# Altium schematic sheet SDRAM_DDR3_4x16.SchDoc: =ProjectName
size 420 x 297 mm; Author: T.P.; CompanyName: WUT; DrawnBy: T.P.; Organization: WUT ISE; Address1: Warsaw Univeristy of Technology; Address2: Nowowiejska 15/19; DocumentNumber: 23; Revision: 0.9; SheetNumber: 23; SheetTotal: 36; EDA_Number: ARTIQ; Projet: ARTIQ/SINARA; ModifiedBy: -; CreateDate: XX/XX/XXXX; CheckedDate: -; Title2: SDRAM_DDR3_4x16.SchDoc; DivGrp: ISE; Designer: G.K. and T.P.; ModifiedDate: -; ProjectName: ADC/DAC MEZZANINE
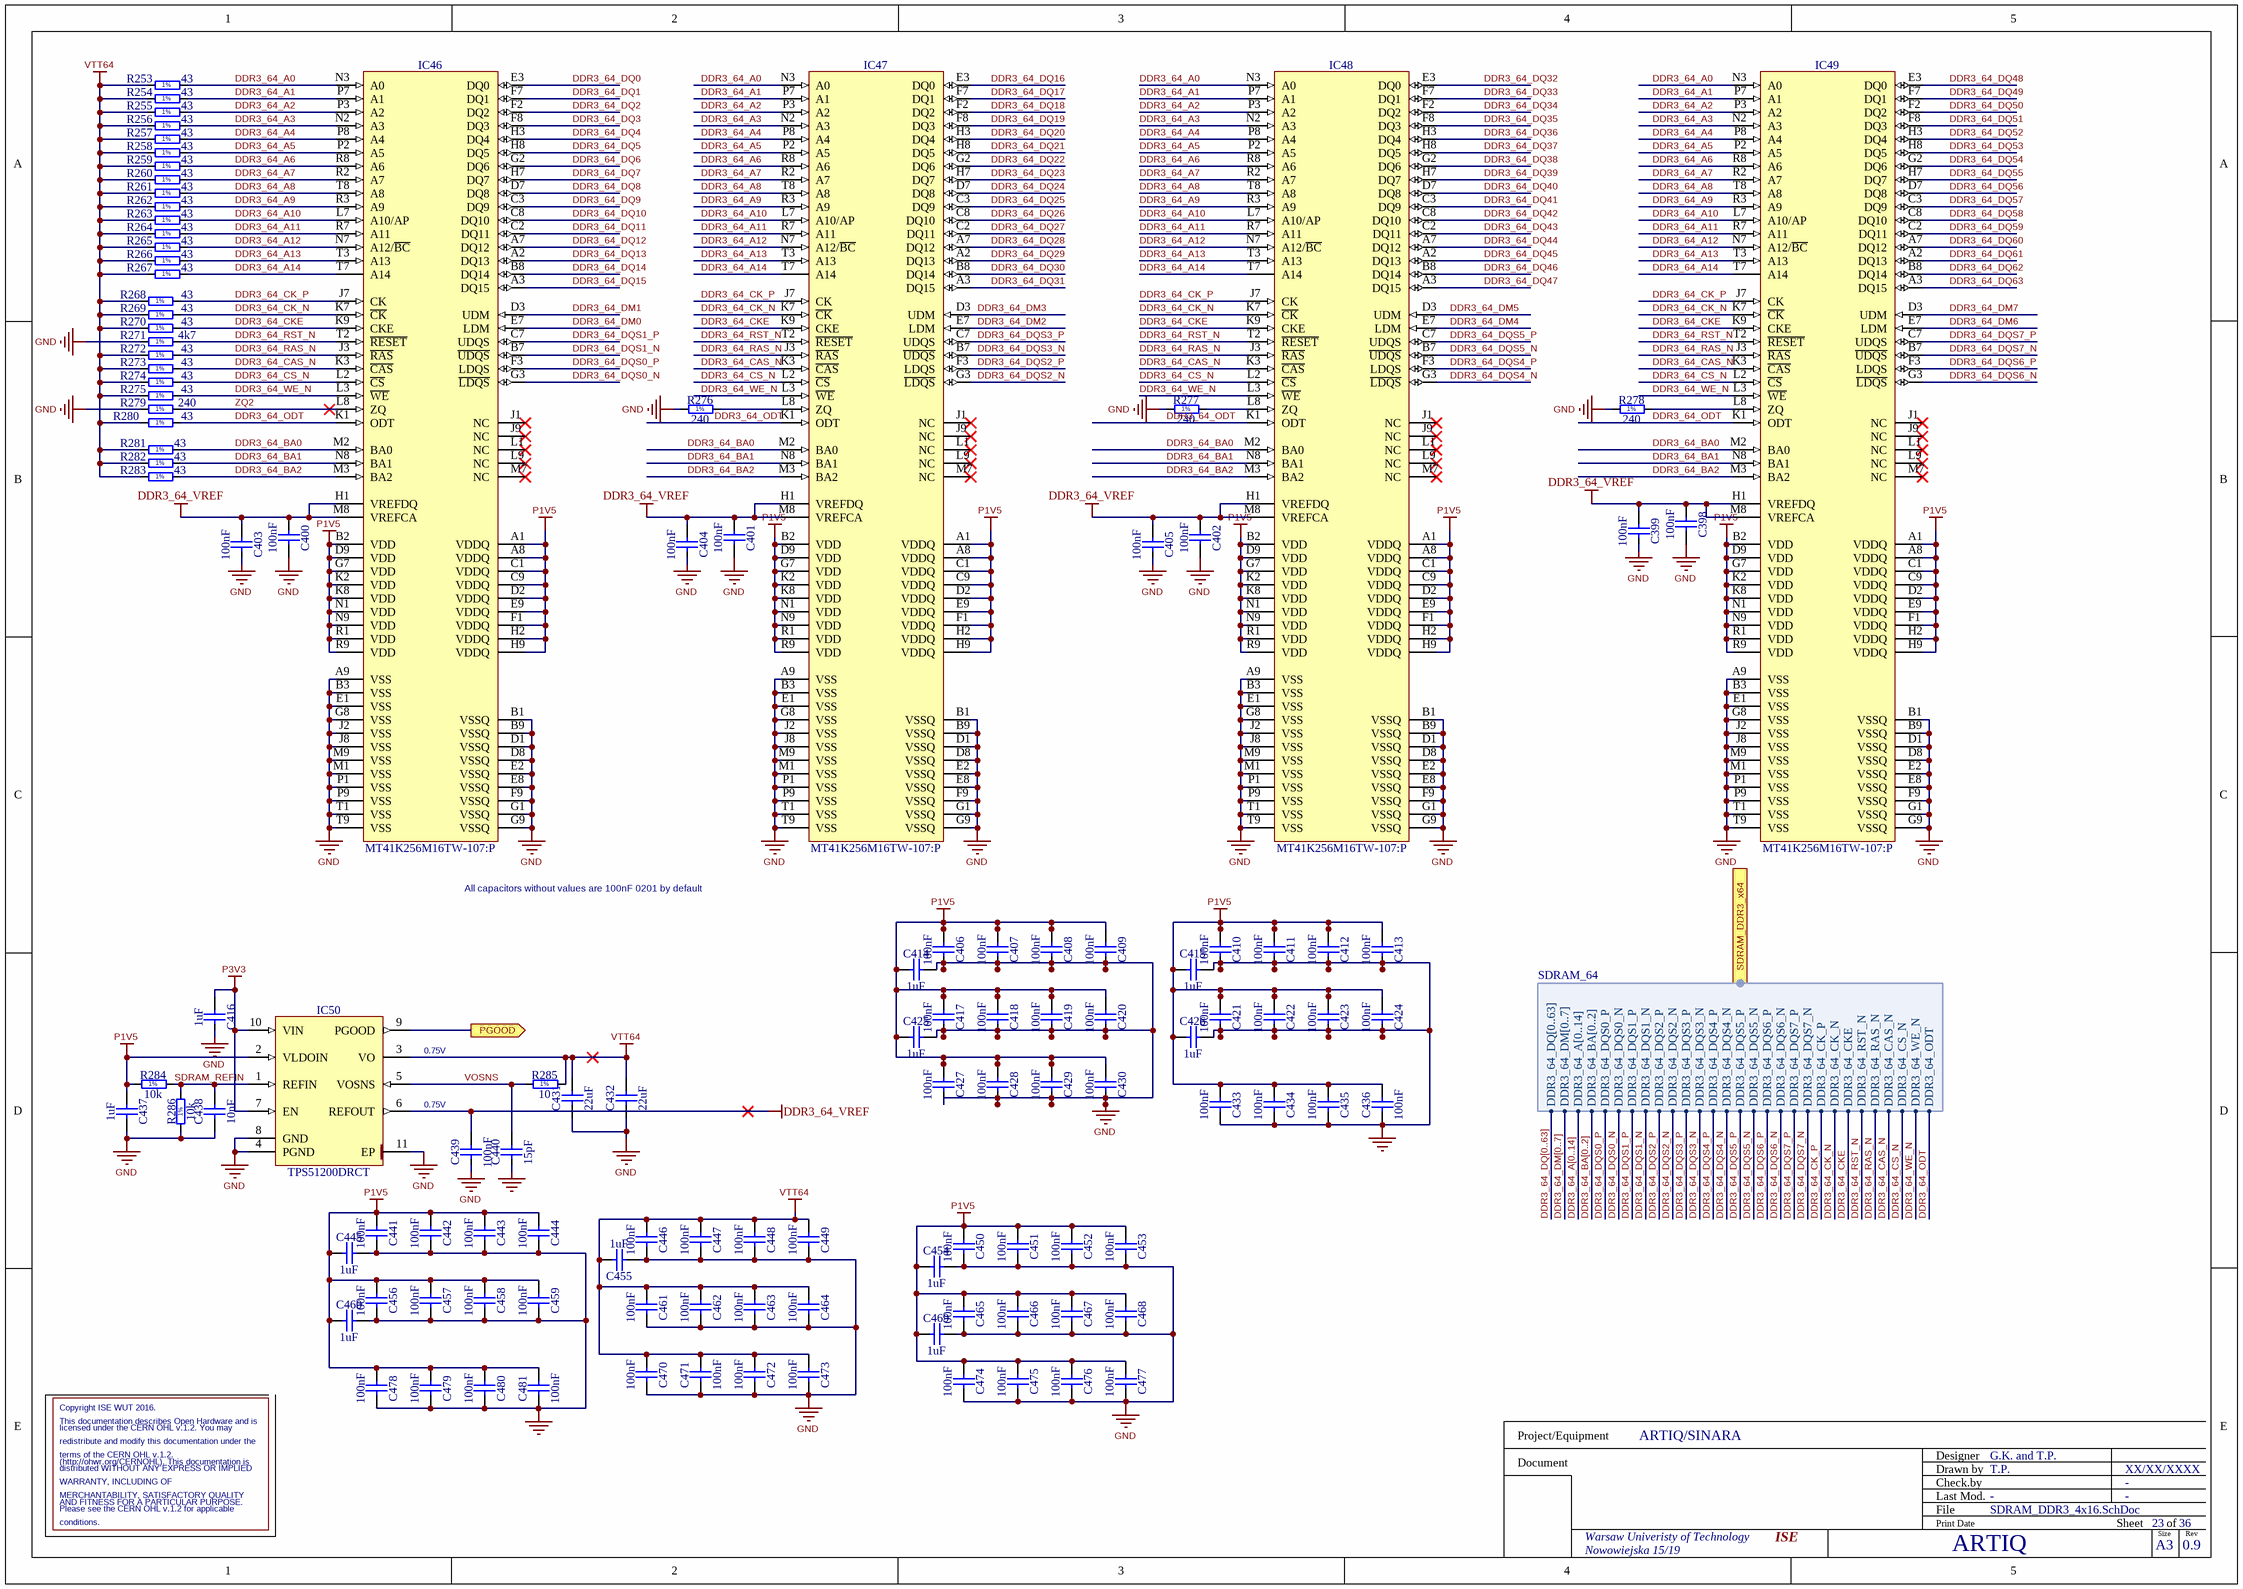
[diagram p0: SDRAM_DDR3_4x16.SchDoc]

## Parts
C398  100nF  [CAPC0603X33N]
C399  100nF  [CAPC0603X33N]
C400  100nF  [CAPC0603X33N]
C401  100nF  [CAPC0603X33N]
C402  100nF  [CAPC0603X33N]
C403  100nF  [CAPC0603X33N]
C404  100nF  [CAPC0603X33N]
C405  100nF  [CAPC0603X33N]
C406  100nF  [CAPC0603X33N]
C407  100nF  [CAPC0603X33N]
C408  100nF  [CAPC0603X33N]
C409  100nF  [CAPC0603X33N]
C410  100nF  [CAPC0603X33N]
C411  100nF  [CAPC0603X33N]
C412  100nF  [CAPC0603X33N]
C413  100nF  [CAPC0603X33N]
C414  1uF  [CAPC1005X55N]
C415  1uF  [CAPC1005X55N]
C416  1uF  [CAPC1005X55N]
C417  100nF  [CAPC0603X33N]
C418  100nF  [CAPC0603X33N]
C419  100nF  [CAPC0603X33N]
C420  100nF  [CAPC0603X33N]
C421  100nF  [CAPC0603X33N]
C422  100nF  [CAPC0603X33N]
C423  100nF  [CAPC0603X33N]
C424  100nF  [CAPC0603X33N]
C425  1uF  [CAPC1005X55N]
C426  1uF  [CAPC1005X55N]
C427  100nF  [CAPC0603X33N]
C428  100nF  [CAPC0603X33N]
C429  100nF  [CAPC0603X33N]
C430  100nF  [CAPC0603X33N]
C431  22uF  [CAPC2012X135N]
C432  22uF  [CAPC2012X135N]
C433  100nF  [CAPC0603X33N]
C434  100nF  [CAPC0603X33N]
C435  100nF  [CAPC0603X33N]
C436  100nF  [CAPC0603X33N]
C437  1uF  [CAPC1005X55N]
C438  10nF  [CAPC1005X55N]
C439  100nF  [CAPC0603X33N]
C440  15pF  [CAPC1005X55N]
C441  100nF  [CAPC0603X33N]
C442  100nF  [CAPC0603X33N]
C443  100nF  [CAPC0603X33N]
C444  100nF  [CAPC0603X33N]
C445  1uF  [CAPC1005X55N]
C446  100nF  [CAPC0603X33N]
C447  100nF  [CAPC0603X33N]
C448  100nF  [CAPC0603X33N]
C449  100nF  [CAPC0603X33N]
C450  100nF  [CAPC0603X33N]
C451  100nF  [CAPC0603X33N]
C452  100nF  [CAPC0603X33N]
C453  100nF  [CAPC0603X33N]
C454  1uF  [CAPC1005X55N]
C455  1uF  [CAPC1005X55N]
C456  100nF  [CAPC0603X33N]
C457  100nF  [CAPC0603X33N]
C458  100nF  [CAPC0603X33N]
C459  100nF  [CAPC0603X33N]
C460  1uF  [CAPC1005X55N]
C461  100nF  [CAPC0603X33N]
C462  100nF  [CAPC0603X33N]
C463  100nF  [CAPC0603X33N]
C464  100nF  [CAPC0603X33N]
C465  100nF  [CAPC0603X33N]
C466  100nF  [CAPC0603X33N]
C467  100nF  [CAPC0603X33N]
C468  100nF  [CAPC0603X33N]
C469  1uF  [CAPC1005X55N]
C470  100nF  [CAPC0603X33N]
C471  100nF  [CAPC0603X33N]
C472  100nF  [CAPC0603X33N]
C473  100nF  [CAPC0603X33N]
C474  100nF  [CAPC0603X33N]
C475  100nF  [CAPC0603X33N]
C476  100nF  [CAPC0603X33N]
C477  100nF  [CAPC0603X33N]
C478  100nF  [CAPC0603X33N]
C479  100nF  [CAPC0603X33N]
C480  100nF  [CAPC0603X33N]
C481  100nF  [CAPC0603X33N]
IC46  MT41K256M16TW-107:P  [BGA96C80P9X16_800X1400X120]
IC47  MT41K256M16TW-107:P  [BGA96C80P9X16_800X1400X120]
IC48  MT41K256M16TW-107:P  [BGA96C80P9X16_800X1400X120]
IC49  MT41K256M16TW-107:P  [BGA96C80P9X16_800X1400X120]
IC50  TPS51200DRCT  [TEXAS_DRC (S-PVSON-N10)]
R253  43  [RESC1005X40N]
R254  43  [RESC1005X40N]
R255  43  [RESC1005X40N]
R256  43  [RESC1005X40N]
R257  43  [RESC1005X40N]
R258  43  [RESC1005X40N]
R259  43  [RESC1005X40N]
R260  43  [RESC1005X40N]
R261  43  [RESC1005X40N]
R262  43  [RESC1005X40N]
R263  43  [RESC1005X40N]
R264  43  [RESC1005X40N]
R265  43  [RESC1005X40N]
R266  43  [RESC1005X40N]
R267  43  [RESC1005X40N]
R268  43  [RESC1005X40N]
R269  43  [RESC1005X40N]
R270  43  [RESC1005X40N]
R271  4k7  [RESC1005X40N]
R272  43  [RESC1005X40N]
R273  43  [RESC1005X40N]
R274  43  [RESC1005X40N]
R275  43  [RESC1005X40N]
R276  240  [RESC1005X40N]
R277  240  [RESC1005X40N]
R278  240  [RESC1005X40N]
R279  240  [RESC1005X40N]
R280  43  [RESC1005X40N]
R281  43  [RESC1005X40N]
R282  43  [RESC1005X40N]
R283  43  [RESC1005X40N]
R284  10k  [RESC1005X40N]
R285  10  [RESC1005X40N]
R286  10k  [RESC1005X40N]

## Ports
PGOOD (out), SDRAM_DDR3_x64 (harness SDRAM_64)

## Harnesses
SDRAM_64: DDR3_64_DQ[0..63], DDR3_64_DM[0..7], DDR3_64_A[0..14], DDR3_64_BA[0..2], DDR3_64_DQS1_P, DDR3_64_DQS0_N, DDR3_64_DQS0_P, DDR3_64_DQS5_P, DDR3_64_DQS5_N, DDR3_64_DQS6_P, DDR3_64_DQS6_N, DDR3_64_DQS7_P, DDR3_64_DQS7_N, DDR3_64_CK_P, DDR3_64_CK_N, DDR3_64_CKE, DDR3_64_RST_N, DDR3_64_RAS_N, DDR3_64_CAS_N, DDR3_64_WE_N, DDR3_64_CS_N, DDR3_64_DQS2_N, DDR3_64_DQS2_P, DDR3_64_DQS1_N, DDR3_64_DQS3_P, DDR3_64_ODT, DDR3_64_DQS4_P, DDR3_64_DQS3_N, DDR3_64_DQS4_N

## Nets
DDR3_64_VREF: C398.1 C399.1 C400.1 C401.1 C402.1 C403.1 C404.1 C405.1 C439.2 IC46.H1(VREFDQ) IC46.M8(VREFCA) IC47.H1(VREFDQ) IC47.M8(VREFCA) IC48.H1(VREFDQ) IC48.M8(VREFCA) IC49.H1(VREFDQ) IC49.M8(VREFCA) IC50.6(REFOUT)
GND: C398.2 C399.2 C400.2 C401.2 C402.2 C403.2 C404.2 C405.2 C406.2 C407.2 C408.2 C409.2 C410.2 C411.2 C412.2 C413.2 C414.2 C415.2 C416.2 C417.2 C418.2 C419.2 C420.2 C421.2 C422.2 C423.2 C424.2 C425.2 C426.2 C427.2 C428.2 C429.2 C430.2 C431.1 C432.1 C433.2 C434.2 C435.2 C436.1 C437.2 C438.1 C439.1 C440.1 C441.2 C442.2 C443.2 C444.2 C445.2 C446.2 C447.2 C448.2 C449.2 C450.2 C451.2 C452.2 C453.2 C454.2 C455.2 C456.2 C457.2 C458.2 C459.2 C460.2 C461.2 C462.2 C463.2 C464.2 C465.2 C466.2 C467.2 C468.2 C469.2 C470.2 C471.2 C472.2 C473.2 C474.2 C475.2 C476.2 C477.2 C478.2 C479.2 C480.2 C481.1 IC46.A9(VSS) IC46.B1(VSSQ) IC46.B3(VSS) IC46.B9(VSSQ) IC46.D1(VSSQ) IC46.D8(VSSQ) IC46.E1(VSS) IC46.E2(VSSQ) IC46.E8(VSSQ) IC46.F9(VSSQ) IC46.G1(VSSQ) IC46.G8(VSS) IC46.G9(VSSQ) IC46.J2(VSS) IC46.J8(VSS) IC46.M1(VSS) IC46.M9(VSS) IC46.P1(VSS) IC46.P9(VSS) IC46.T1(VSS) IC46.T9(VSS) IC47.A9(VSS) IC47.B1(VSSQ) IC47.B3(VSS) IC47.B9(VSSQ) IC47.D1(VSSQ) IC47.D8(VSSQ) IC47.E1(VSS) IC47.E2(VSSQ) IC47.E8(VSSQ) IC47.F9(VSSQ) IC47.G1(VSSQ) IC47.G8(VSS) IC47.G9(VSSQ) IC47.J2(VSS) IC47.J8(VSS) IC47.M1(VSS) IC47.M9(VSS) IC47.P1(VSS) IC47.P9(VSS) IC47.T1(VSS) IC47.T9(VSS) IC48.A9(VSS) IC48.B1(VSSQ) IC48.B3(VSS) IC48.B9(VSSQ) IC48.D1(VSSQ) IC48.D8(VSSQ) IC48.E1(VSS) IC48.E2(VSSQ) IC48.E8(VSSQ) IC48.F9(VSSQ) IC48.G1(VSSQ) IC48.G8(VSS) IC48.G9(VSSQ) IC48.J2(VSS) IC48.J8(VSS) IC48.M1(VSS) IC48.M9(VSS) IC48.P1(VSS) IC48.P9(VSS) IC48.T1(VSS) IC48.T9(VSS) IC49.A9(VSS) IC49.B1(VSSQ) IC49.B3(VSS) IC49.B9(VSSQ) IC49.D1(VSSQ) IC49.D8(VSSQ) IC49.E1(VSS) IC49.E2(VSSQ) IC49.E8(VSSQ) IC49.F9(VSSQ) IC49.G1(VSSQ) IC49.G8(VSS) IC49.G9(VSSQ) IC49.J2(VSS) IC49.J8(VSS) IC49.M1(VSS) IC49.M9(VSS) IC49.P1(VSS) IC49.P9(VSS) IC49.T1(VSS) IC49.T9(VSS) IC50.4(PGND) IC50.8(GND) IC50.11(EP) R271.1 R276.1 R277.1 R278.1 R279.1 R286.1
P1V5: C406.1 C407.1 C408.1 C409.1 C410.1 C411.1 C412.1 C413.1 C414.1 C415.1 C417.1 C418.1 C419.1 C420.1 C421.1 C422.1 C423.1 C424.1 C425.1 C426.1 C427.1 C428.1 C429.1 C430.1 C433.1 C434.1 C435.1 C436.2 C437.1 C441.1 C442.1 C443.1 C444.1 C445.1 C450.1 C451.1 C452.1 C453.1 C454.1 C456.1 C457.1 C458.1 C459.1 C460.1 C465.1 C466.1 C467.1 C468.1 C469.1 C474.1 C475.1 C476.1 C477.1 C478.1 C479.1 C480.1 C481.2 IC46.A1(VDDQ) IC46.A8(VDDQ) IC46.B2(VDD) IC46.C1(VDDQ) IC46.C9(VDDQ) IC46.D2(VDDQ) IC46.D9(VDD) IC46.E9(VDDQ) IC46.F1(VDDQ) IC46.G7(VDD) IC46.H2(VDDQ) IC46.H9(VDDQ) IC46.K2(VDD) IC46.K8(VDD) IC46.N1(VDD) IC46.N9(VDD) IC46.R1(VDD) IC46.R9(VDD) IC47.A1(VDDQ) IC47.A8(VDDQ) IC47.B2(VDD) IC47.C1(VDDQ) IC47.C9(VDDQ) IC47.D2(VDDQ) IC47.D9(VDD) IC47.E9(VDDQ) IC47.F1(VDDQ) IC47.G7(VDD) IC47.H2(VDDQ) IC47.H9(VDDQ) IC47.K2(VDD) IC47.K8(VDD) IC47.N1(VDD) IC47.N9(VDD) IC47.R1(VDD) IC47.R9(VDD) IC48.A1(VDDQ) IC48.A8(VDDQ) IC48.B2(VDD) IC48.C1(VDDQ) IC48.C9(VDDQ) IC48.D2(VDDQ) IC48.D9(VDD) IC48.E9(VDDQ) IC48.F1(VDDQ) IC48.G7(VDD) IC48.H2(VDDQ) IC48.H9(VDDQ) IC48.K2(VDD) IC48.K8(VDD) IC48.N1(VDD) IC48.N9(VDD) IC48.R1(VDD) IC48.R9(VDD) IC49.A1(VDDQ) IC49.A8(VDDQ) IC49.B2(VDD) IC49.C1(VDDQ) IC49.C9(VDDQ) IC49.D2(VDDQ) IC49.D9(VDD) IC49.E9(VDDQ) IC49.F1(VDDQ) IC49.G7(VDD) IC49.H2(VDDQ) IC49.H9(VDDQ) IC49.K2(VDD) IC49.K8(VDD) IC49.N1(VDD) IC49.N9(VDD) IC49.R1(VDD) IC49.R9(VDD) IC50.2(VLDOIN) R284.1
P3V3: C416.1 IC50.7(EN) IC50.10(VIN)
VTT64: C431.2 C432.2 C446.1 C447.1 C448.1 C449.1 C455.1 C461.1 C462.1 C463.1 C464.1 C470.1 C471.1 C472.1 C473.1 IC50.3(VO) R253.1 R254.1 R255.1 R256.1 R257.1 R258.1 R259.1 R260.1 R261.1 R262.1 R263.1 R264.1 R265.1 R266.1 R267.1 R268.1 R269.1 R270.1 R272.1 R273.1 R274.1 R275.1 R280.1 R281.1 R282.1 R283.1 R285.2
DDR3_64_A0: IC46.N3(A0) IC47.N3(A0) IC48.N3(A0) IC49.N3(A0) R253.2
DDR3_64_A1: IC46.P7(A1) IC47.P7(A1) IC48.P7(A1) IC49.P7(A1) R254.2
DDR3_64_A2: IC46.P3(A2) IC47.P3(A2) IC48.P3(A2) IC49.P3(A2) R255.2
DDR3_64_A3: IC46.N2(A3) IC47.N2(A3) IC48.N2(A3) IC49.N2(A3) R256.2
DDR3_64_A4: IC46.P8(A4) IC47.P8(A4) IC48.P8(A4) IC49.P8(A4) R257.2
DDR3_64_A5: IC46.P2(A5) IC47.P2(A5) IC48.P2(A5) IC49.P2(A5) R258.2
DDR3_64_A6: IC46.R8(A6) IC47.R8(A6) IC48.R8(A6) IC49.R8(A6) R259.2
DDR3_64_A7: IC46.R2(A7) IC47.R2(A7) IC48.R2(A7) IC49.R2(A7) R260.2
DDR3_64_A8: IC46.T8(A8) IC47.T8(A8) IC48.T8(A8) IC49.T8(A8) R261.2
DDR3_64_A9: IC46.R3(A9) IC47.R3(A9) IC48.R3(A9) IC49.R3(A9) R262.2
DDR3_64_A10: IC46.L7(A10/AP) IC47.L7(A10/AP) IC48.L7(A10/AP) IC49.L7(A10/AP) R263.2
DDR3_64_A11: IC46.R7(A11) IC47.R7(A11) IC48.R7(A11) IC49.R7(A11) R264.2
DDR3_64_A12: IC46.N7(A12/~{BC}) IC47.N7(A12/~{BC}) IC48.N7(A12/~{BC}) IC49.N7(A12/~{BC}) R265.2
DDR3_64_A13: IC46.T3(A13) IC47.T3(A13) IC48.T3(A13) IC49.T3(A13) R266.2
DDR3_64_A14: IC46.T7(A14) IC47.T7(A14) IC48.T7(A14) IC49.T7(A14) R267.2
DDR3_64_BA0: IC46.M2(BA0) IC47.M2(BA0) IC48.M2(BA0) IC49.M2(BA0) R281.2
DDR3_64_BA1: IC46.N8(BA1) IC47.N8(BA1) IC48.N8(BA1) IC49.N8(BA1) R282.2
DDR3_64_BA2: IC46.M3(BA2) IC47.M3(BA2) IC48.M3(BA2) IC49.M3(BA2) R283.2
DDR3_64_CAS_N: IC46.K3(~{CAS}) IC47.K3(~{CAS}) IC48.K3(~{CAS}) IC49.K3(~{CAS}) R273.2 ; port SDRAM_DDR3_x64.DDR3_64_CAS_N
DDR3_64_CK_N: IC46.K7(~{CK}) IC47.K7(~{CK}) IC48.K7(~{CK}) IC49.K7(~{CK}) R269.2 ; port SDRAM_DDR3_x64.DDR3_64_CK_N
DDR3_64_CK_P: IC46.J7(CK) IC47.J7(CK) IC48.J7(CK) IC49.J7(CK) R268.2 ; port SDRAM_DDR3_x64.DDR3_64_CK_P
DDR3_64_CKE: IC46.K9(CKE) IC47.K9(CKE) IC48.K9(CKE) IC49.K9(CKE) R270.2 ; port SDRAM_DDR3_x64.DDR3_64_CKE
DDR3_64_CS_N: IC46.L2(~{CS}) IC47.L2(~{CS}) IC48.L2(~{CS}) IC49.L2(~{CS}) R274.2 ; port SDRAM_DDR3_x64.DDR3_64_CS_N
DDR3_64_DM0: IC46.E7(LDM)
DDR3_64_DM1: IC46.D3(UDM)
DDR3_64_DM2: IC47.E7(LDM)
DDR3_64_DM3: IC47.D3(UDM)
DDR3_64_DM4: IC48.E7(LDM)
DDR3_64_DM5: IC48.D3(UDM)
DDR3_64_DM6: IC49.E7(LDM)
DDR3_64_DM7: IC49.D3(UDM)
DDR3_64_DQ0: IC46.E3(DQ0)
DDR3_64_DQ1: IC46.F7(DQ1)
DDR3_64_DQ2: IC46.F2(DQ2)
DDR3_64_DQ3: IC46.F8(DQ3)
DDR3_64_DQ4: IC46.H3(DQ4)
DDR3_64_DQ5: IC46.H8(DQ5)
DDR3_64_DQ6: IC46.G2(DQ6)
DDR3_64_DQ7: IC46.H7(DQ7)
DDR3_64_DQ8: IC46.D7(DQ8)
DDR3_64_DQ9: IC46.C3(DQ9)
DDR3_64_DQ10: IC46.C8(DQ10)
DDR3_64_DQ11: IC46.C2(DQ11)
DDR3_64_DQ12: IC46.A7(DQ12)
DDR3_64_DQ13: IC46.A2(DQ13)
DDR3_64_DQ14: IC46.B8(DQ14)
DDR3_64_DQ15: IC46.A3(DQ15)
DDR3_64_DQ16: IC47.E3(DQ0)
DDR3_64_DQ17: IC47.F7(DQ1)
DDR3_64_DQ18: IC47.F2(DQ2)
DDR3_64_DQ19: IC47.F8(DQ3)
DDR3_64_DQ20: IC47.H3(DQ4)
DDR3_64_DQ21: IC47.H8(DQ5)
DDR3_64_DQ22: IC47.G2(DQ6)
DDR3_64_DQ23: IC47.H7(DQ7)
DDR3_64_DQ24: IC47.D7(DQ8)
DDR3_64_DQ25: IC47.C3(DQ9)
DDR3_64_DQ26: IC47.C8(DQ10)
DDR3_64_DQ27: IC47.C2(DQ11)
DDR3_64_DQ28: IC47.A7(DQ12)
DDR3_64_DQ29: IC47.A2(DQ13)
DDR3_64_DQ30: IC47.B8(DQ14)
DDR3_64_DQ31: IC47.A3(DQ15)
DDR3_64_DQ32: IC48.E3(DQ0)
DDR3_64_DQ33: IC48.F7(DQ1)
DDR3_64_DQ34: IC48.F2(DQ2)
DDR3_64_DQ35: IC48.F8(DQ3)
DDR3_64_DQ36: IC48.H3(DQ4)
DDR3_64_DQ37: IC48.H8(DQ5)
DDR3_64_DQ38: IC48.G2(DQ6)
DDR3_64_DQ39: IC48.H7(DQ7)
DDR3_64_DQ40: IC48.D7(DQ8)
DDR3_64_DQ41: IC48.C3(DQ9)
DDR3_64_DQ42: IC48.C8(DQ10)
DDR3_64_DQ43: IC48.C2(DQ11)
DDR3_64_DQ44: IC48.A7(DQ12)
DDR3_64_DQ45: IC48.A2(DQ13)
DDR3_64_DQ46: IC48.B8(DQ14)
DDR3_64_DQ47: IC48.A3(DQ15)
DDR3_64_DQ48: IC49.E3(DQ0)
DDR3_64_DQ49: IC49.F7(DQ1)
DDR3_64_DQ50: IC49.F2(DQ2)
DDR3_64_DQ51: IC49.F8(DQ3)
DDR3_64_DQ52: IC49.H3(DQ4)
DDR3_64_DQ53: IC49.H8(DQ5)
DDR3_64_DQ54: IC49.G2(DQ6)
DDR3_64_DQ55: IC49.H7(DQ7)
DDR3_64_DQ56: IC49.D7(DQ8)
DDR3_64_DQ57: IC49.C3(DQ9)
DDR3_64_DQ58: IC49.C8(DQ10)
DDR3_64_DQ59: IC49.C2(DQ11)
DDR3_64_DQ60: IC49.A7(DQ12)
DDR3_64_DQ61: IC49.A2(DQ13)
DDR3_64_DQ62: IC49.B8(DQ14)
DDR3_64_DQ63: IC49.A3(DQ15)
DDR3_64_DQS0_N: IC46.G3(~{LDQS}) ; port SDRAM_DDR3_x64.DDR3_64_DQS0_N
DDR3_64_DQS0_P: IC46.F3(LDQS) ; port SDRAM_DDR3_x64.DDR3_64_DQS0_P
DDR3_64_DQS1_N: IC46.B7(~{UDQS}) ; port SDRAM_DDR3_x64.DDR3_64_DQS1_N
DDR3_64_DQS1_P: IC46.C7(UDQS) ; port SDRAM_DDR3_x64.DDR3_64_DQS1_P
DDR3_64_DQS2_N: IC47.G3(~{LDQS}) ; port SDRAM_DDR3_x64.DDR3_64_DQS2_N
DDR3_64_DQS2_P: IC47.F3(LDQS) ; port SDRAM_DDR3_x64.DDR3_64_DQS2_P
DDR3_64_DQS3_N: IC47.B7(~{UDQS}) ; port SDRAM_DDR3_x64.DDR3_64_DQS3_N
DDR3_64_DQS3_P: IC47.C7(UDQS) ; port SDRAM_DDR3_x64.DDR3_64_DQS3_P
DDR3_64_DQS4_N: IC48.G3(~{LDQS}) ; port SDRAM_DDR3_x64.DDR3_64_DQS4_N
DDR3_64_DQS4_P: IC48.F3(LDQS) ; port SDRAM_DDR3_x64.DDR3_64_DQS4_P
DDR3_64_DQS5_N: IC48.B7(~{UDQS}) ; port SDRAM_DDR3_x64.DDR3_64_DQS5_N
DDR3_64_DQS5_P: IC48.C7(UDQS) ; port SDRAM_DDR3_x64.DDR3_64_DQS5_P
DDR3_64_DQS6_N: IC49.G3(~{LDQS}) ; port SDRAM_DDR3_x64.DDR3_64_DQS6_N
DDR3_64_DQS6_P: IC49.F3(LDQS) ; port SDRAM_DDR3_x64.DDR3_64_DQS6_P
DDR3_64_DQS7_N: IC49.B7(~{UDQS}) ; port SDRAM_DDR3_x64.DDR3_64_DQS7_N
DDR3_64_DQS7_P: IC49.C7(UDQS) ; port SDRAM_DDR3_x64.DDR3_64_DQS7_P
DDR3_64_ODT: IC46.K1(ODT) IC47.K1(ODT) IC48.K1(ODT) IC49.K1(ODT) R280.2 ; port SDRAM_DDR3_x64.DDR3_64_ODT
DDR3_64_RAS_N: IC46.J3(~{RAS}) IC47.J3(~{RAS}) IC48.J3(~{RAS}) IC49.J3(~{RAS}) R272.2 ; port SDRAM_DDR3_x64.DDR3_64_RAS_N
DDR3_64_RST_N: IC46.T2(~{RESET}) IC47.T2(~{RESET}) IC48.T2(~{RESET}) IC49.T2(~{RESET}) R271.2 ; port SDRAM_DDR3_x64.DDR3_64_RST_N
DDR3_64_WE_N: IC46.L3(~{WE}) IC47.L3(~{WE}) IC48.L3(~{WE}) IC49.L3(~{WE}) R275.2 ; port SDRAM_DDR3_x64.DDR3_64_WE_N
PGOOD: IC50.9(PGOOD) ; port PGOOD
SDRAM_REFIN: C438.2 IC50.1(REFIN) R284.2 R286.2
VOSNS: C440.2 IC50.5(VOSNS) R285.1
ZQ2: IC46.L8(ZQ) R279.2
NetIC47_L8: IC47.L8(ZQ) R276.2
NetIC48_L8: IC48.L8(ZQ) R277.2
NetIC49_L8: IC49.L8(ZQ) R278.2

Not connected (* = marked no-connect by the designer): IC46 J1(NC)* J9(NC)* L1(NC)* L9(NC)* M7(NC)*; IC47 J1(NC)* J9(NC)* L1(NC)* L9(NC)* M7(NC)*; IC48 J1(NC)* J9(NC)* L1(NC)* L9(NC)* M7(NC)*; IC49 J1(NC)* J9(NC)* L1(NC)* L9(NC)* M7(NC)*

## Buses and harness runs
bus DDR3_64_A[0..14]
bus DDR3_64_BA[0..2]
bus DDR3_64_DM[0..7]
bus DDR3_64_DQ[0..63]

## Notes on the sheet
- All capacitors without values are 100nF 0201 by default
- (near IC50) 0.75V
- 0.75V
- Copyright ISE WUT 2016.
- terms of the CERN OHL v.1.2.
- This documentation describes Open Hardware and is
- (http://ohwr.org/CERNOHL). This documentation is
- redistribute and modify this documentation under the
- distributed WITHOUT ANY EXPRESS OR IMPLIED
- WARRANTY, INCLUDING OF
- licensed under the CERN OHL v.1.2. You may
- Please see the CERN OHL v.1.2 for applicable
- conditions.
- MERCHANTABILITY, SATISFACTORY QUALITY
- AND FITNESS FOR A PARTICULAR PURPOSE.
- Project/Equipment
- Document
- Designer
- Drawn by
- Check.by
- File
- Last Mod.
- Print Date
- Sheet
- Size
- A3
- of
- Rev
- (in symbol R0402_4K7_1%_0.0625W_100PPM) 1%
- (in symbol R0402_10K_1%_0.0625W_100PPM) 1%
- (in symbol R0402_10R_1%_0.0625W_200PPM) 1%
- (in symbol R0402_43R_1%_0.0625W_100PPM) 1%
- (in symbol R0402_240R_1%_0.0625W_100PPM) 1%

## Library data of the parts
C398-C413 C417-C424 C427-C430 C433-C436 C439 C441-C444 C446-C453 C456-C459 C461-C468 C470-C481 = CC0201_100NF_6.3V_10%_X5R: Non-polarised capacitor; Manufacturer: GENERIC; Manufacturer1 Part Number: 02016D104KAT2A; Part Description: SMD Multilayer Chip Ceramic Capacitor; TC: X5R; Tolerance: ±10%; Voltage: 6.3V; Author: CERN DEM JLC; Case: 0201; Component Kind: Standard; Component Type: Standard; CreateDate: 03.12.2007; HelpURL: \\cern.ch\dfs\Applications\Altium\Datasheets\CC0201_X5R_AVX.pdf; LatestRevisionDate: 03.12.2007; Manufacturer Part Number: CC0201_100NF_6.3V_10%_X5R; Manufacturer1 ComponentHeight: 0.33mm; Manufacturer1 Example: AVX; Mounted: Yes; Part Number: CC0201_100NF_6.3V_10%_X5R; Pin Count: 2; SMD: Yes; Socket: No; Status: Not Recommended; Value: 100nF; Sense: No
C414-C416 C425 C426 C437 C445 C454 C455 C460 C469 = CC0402_1UF_16V_10%_X5R: Non-polarised capacitor; Manufacturer: GENERIC; Part Description: SMD Multilayer Chip Ceramic Capacitor; Manufacturer1 Part Number: C1005X5R1C105KT; Tolerance: ±10%; Voltage: 16V; TC: X5R; Manufacturer Part Number: CC0402_1UF_16V_10%_X5R; Part Number: CC0402_1UF_16V_10%_X5R; Value: 1uF; Component Kind: Standard; Component Type: Standard; Pin Count: 2; Status: Preferred; Case: 0402; Mounted: Yes; Socket: No; SMD: Yes; Sense: No; Manufacturer1 Example: TDK; Manufacturer1 ComponentHeight: 0.55mm; HelpURL: \\cern.ch\dfs\Applications\Altium\Datasheets\CC0402_X5R_TDK_C.pdf; Author: CERN DEM JLC; CreateDate: 25.10.2012; LatestRevisionDate: 25.10.2012
C431 C432 = CC0805_22UF_10V_+80%-20%_Y5V: Non-polarised capacitor; Manufacturer: GENERIC; Part Description: SMD Multilayer Chip Ceramic Capacitor; Manufacturer1 Part Number: 2222 241 19881; Voltage: 10V; TC: Y5V; Manufacturer Part Number: CC0805_22UF_10V_+80%-20%_Y5V; Part Number: CC0805_22UF_10V_+80%-20%_Y5V; Tolerance: +80% -20%; Value: 22uF; Component Kind: Standard; Component Type: Standard; Pin Count: 2; Status: Preferred; Case: 0805; Mounted: Yes; Socket: No; SMD: Yes; Sense: No; Manufacturer1 Example: PHYCOMP; Manufacturer1 ComponentHeight: 1.45mm; HelpURL: \\cern.ch\dfs\Applications\Altium\Datasheets\CC0805_Y5V_PHYCOMP.pdf; Author: CERN DEM JLC; CreateDate: 03.12.2007; LatestRevisionDate: 03.12.2007
C438 = CC0402_10NF_25V_10%_X7R: Non-polarised capacitor; Manufacturer: GENERIC; Part Description: SMD Multilayer Chip Ceramic Capacitor; Manufacturer1 Part Number: C1005X7R1E103KT; Tolerance: ±10%; Voltage: 25V; TC: X7R; Manufacturer Part Number: CC0402_10NF_25V_10%_X7R; Part Number: CC0402_10NF_25V_10%_X7R; Value: 10nF; Component Kind: Standard; Component Type: Standard; Pin Count: 2; Status: Preferred; Case: 0402; Mounted: Yes; Socket: No; SMD: Yes; Sense: No; Manufacturer1 Example: TDK; Manufacturer1 ComponentHeight: 0.55mm; HelpURL: \\cern.ch\dfs\Applications\Altium\Datasheets\CC0402_X7R_TDK_C.pdf; Author: CERN DEM JLC; CreateDate: 25.10.2012; LatestRevisionDate: 25.10.2012
C440 = CC0402_15PF_50V_5%_C0G: Non-polarised capacitor; Manufacturer: GENERIC; Part Description: SMD Multilayer Chip Ceramic Capacitor; Manufacturer1 Part Number: C0402C150J5GACTU; Tolerance: ±5%; Voltage: 50V; TC: C0G/NP0; Manufacturer Part Number: CC0402_15PF_50V_5%_C0G; Part Number: CC0402_15PF_50V_5%_C0G; Value: 15pF; Component Kind: Standard; Component Type: Standard; Pin Count: 2; Status: Preferred; Case: 0402; Mounted: Yes; Socket: No; SMD: Yes; Sense: No; Manufacturer1 Example: KEMET; Manufacturer1 ComponentHeight: 0.55mm; HelpURL: \\cern.ch\dfs\Applications\Altium\Datasheets\CC0805_C0G_KEMET_(Commercial Grade).pdf; Author: CERN DEM JLC; CreateDate: 03.12.2007; LatestRevisionDate: 22.04.2015
IC46-IC49 = MT41K256M16TW-107:P: 32 Meg x 16 x 8 Banks DDR3L SDRAM; Part Description: +1.5V, 4Gb (32Meg x 16 x 8 banks) DDR3L SDRAM; Manufacturer: MICRON TECHNOLOGY; PressFit: No; Bonding: No; Part Number: MT41K256M16TW-107:P; Component Kind: Standard; Component Type: Standard; Device: MT41K256M16TW-107:P; PackageDescription: BGA 0.8mm, Pitch, Square 96 Pin, 9 Columns x 16 Rows, Body 14mm X 8mm X 1.2mm H; Manufacturer Part Number: MT41K256M16TW-107:P; Pin Count: 96; Case: BGA96; Mounted: Yes; Socket: No; SMD: Yes; Sense: No; ComponentHeight: 1.2mm; HelpURL: \\cern.ch\dfs\Applications\Altium\Datasheets\MT41K256M16TW-107-P.pdf; Author: CERN DEM MR; CreateDate: 14.12.2015; LatestRevisionDate: 14.12.2015
IC50 = TPS51200DRCT: Sink/Source DDR Termination Regulator; Manufacturer: TEXAS INSTRUMENTS; Part Description: 3.3V Sink/Source DDR Termination Regulator; PressFit: No; Bonding: No; Manufacturer Part Number: TPS51200DRCT; PackageDescription: SON, 0.50mm Pitch, 10-pin, 3.00mm W  X 3.00mm L X 1.00mm Height, (w/thermal tab 1.75 X 2.50 mm); Part Number: TPS51200DRCT; Component Kind: Standard; Component Type: Standard; Device: TPS51200DRCT; Pin Count: 11; Case: SON10; Mounted: Yes; Socket: No; SMD: Yes; Sense: No; ComponentHeight: 1mm; HelpURL: \\cern.ch\dfs\Applications\Altium\Datasheets\TPS51200DRCT.pdf; Author: CERN DEM JLC; CreateDate: 03.02.2010; LatestRevisionDate: 06.11.2013
R253-R270 R272-R275 R280-R283 = R0402_43R_1%_0.0625W_100PPM: Resistor - 1%; Manufacturer: GENERIC; Part Description: General Purpose Thick Film Chip Resistor; Manufacturer1 Part Number: 232270674309L; TC: ±100ppm/°C; PressFit: No; Manufacturer Part Number: R0402_43R_1%_0.0625W_100PPM; Part Number: R0402_43R_1%_0.0625W_100PPM; Tolerance: ±1%; Value: 43; Component Kind: Standard; Component Type: Standard; Pin Count: 2; Status: Not Recommended; Power: 0.0625W; Case: 0402; Mounted: Yes; Sense: No; Socket: No; SMD: Yes; Manufacturer1 Example: YAGEO PHYCOMP; Manufacturer1 ComponentHeight: 0.4mm; HelpURL: \\cern.ch\dfs\Applications\Altium\Datasheets\R0402_Phycomp_RC0402.pdf; Author: CERN DEM JLC; CreateDate: 03.12.2007; LatestRevisionDate: 17.10.2012
R271 = R0402_4K7_1%_0.0625W_100PPM: Resistor - 1%; Manufacturer: GENERIC; Part Description: General Purpose Thick Film Chip Resistor; Manufacturer1 Part Number: 232270674702L; TC: ±100ppm/°C; PressFit: No; Manufacturer Part Number: R0402_4K7_1%_0.0625W_100PPM; Part Number: R0402_4K7_1%_0.0625W_100PPM; Tolerance: ±1%; Value: 4k7; Component Kind: Standard; Component Type: Standard; Pin Count: 2; Status: Not Recommended; Power: 0.0625W; Case: 0402; Mounted: Yes; Sense: No; Socket: No; SMD: Yes; Manufacturer1 Example: YAGEO PHYCOMP; Manufacturer1 ComponentHeight: 0.4mm; HelpURL: \\cern.ch\dfs\Applications\Altium\Datasheets\R0402_Phycomp_RC0402.pdf; Author: CERN DEM JLC; CreateDate: 03.12.2007; LatestRevisionDate: 17.10.2012
R276-R279 = R0402_240R_1%_0.0625W_100PPM: Resistor - 1%; Manufacturer: GENERIC; Part Description: General Purpose Thick Film Chip Resistor; Manufacturer1 Part Number: 232270672401L; TC: ±100ppm/°C; PressFit: No; Manufacturer Part Number: R0402_240R_1%_0.0625W_100PPM; Part Number: R0402_240R_1%_0.0625W_100PPM; Tolerance: ±1%; Value: 240; Component Kind: Standard; Component Type: Standard; Pin Count: 2; Status: Not Recommended; Power: 0.0625W; Case: 0402; Mounted: Yes; Sense: No; Socket: No; SMD: Yes; Manufacturer1 Example: YAGEO PHYCOMP; Manufacturer1 ComponentHeight: 0.4mm; HelpURL: \\cern.ch\dfs\Applications\Altium\Datasheets\R0402_Phycomp_RC0402.pdf; Author: CERN DEM JLC; CreateDate: 03.12.2007; LatestRevisionDate: 17.10.2012
R284 R286 = R0402_10K_1%_0.0625W_100PPM: Resistor - 1%; Manufacturer: GENERIC; Part Description: General Purpose Thick Film Chip Resistor; Manufacturer1 Part Number: 232270671003L; TC: ±100ppm/°C; PressFit: No; Manufacturer Part Number: R0402_10K_1%_0.0625W_100PPM; Part Number: R0402_10K_1%_0.0625W_100PPM; Tolerance: ±1%; Value: 10k; Component Kind: Standard; Component Type: Standard; Pin Count: 2; Status: Not Recommended; Power: 0.0625W; Case: 0402; Mounted: Yes; Sense: No; Socket: No; SMD: Yes; Manufacturer1 Example: YAGEO PHYCOMP; Manufacturer1 ComponentHeight: 0.4mm; HelpURL: \\cern.ch\dfs\Applications\Altium\Datasheets\R0402_Phycomp_RC0402.pdf; Author: CERN DEM JLC; CreateDate: 03.12.2007; LatestRevisionDate: 17.10.2012
R285 = R0402_10R_1%_0.0625W_200PPM: Resistor - 1%; Manufacturer: GENERIC; Part Description: General Purpose Thick Film Chip Resistor; Manufacturer1 Part Number: 232270671009L; TC: ±200ppm/°C; PressFit: No; Manufacturer Part Number: R0402_10R_1%_0.0625W_200PPM; Part Number: R0402_10R_1%_0.0625W_200PPM; Tolerance: ±1%; Value: 10; Component Kind: Standard; Component Type: Standard; Pin Count: 2; Status: Not Recommended; Power: 0.0625W; Case: 0402; Mounted: Yes; Sense: No; Socket: No; SMD: Yes; Manufacturer1 Example: YAGEO PHYCOMP; Manufacturer1 ComponentHeight: 0.4mm; HelpURL: \\cern.ch\dfs\Applications\Altium\Datasheets\R0402_Phycomp_RC0402.pdf; Author: CERN DEM JLC; CreateDate: 24.06.2009; LatestRevisionDate: 17.10.2012